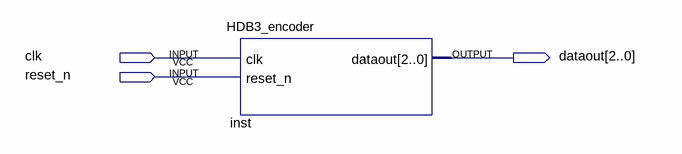
[diagram p0: schematic sheet]
// Quartus schematic chip_HDB3_encoder.bdf as structural Verilog: 1 symbols, 3 pins
module chip_HDB3_encoder (
  input  clk,
  input  reset_n,
  output [2:0] dataout
);

  HDB3_encoder inst (.clk(clk), .reset_n(reset_n), .dataout(dataout));
endmodule
